# EAGLE design emonTx SMT07 (EAGLE 6.2)
ABBREV: emonTx; DRAWING_AUTHOR: Glyn Hudson; PROJECT: OpenEnergyMonitor
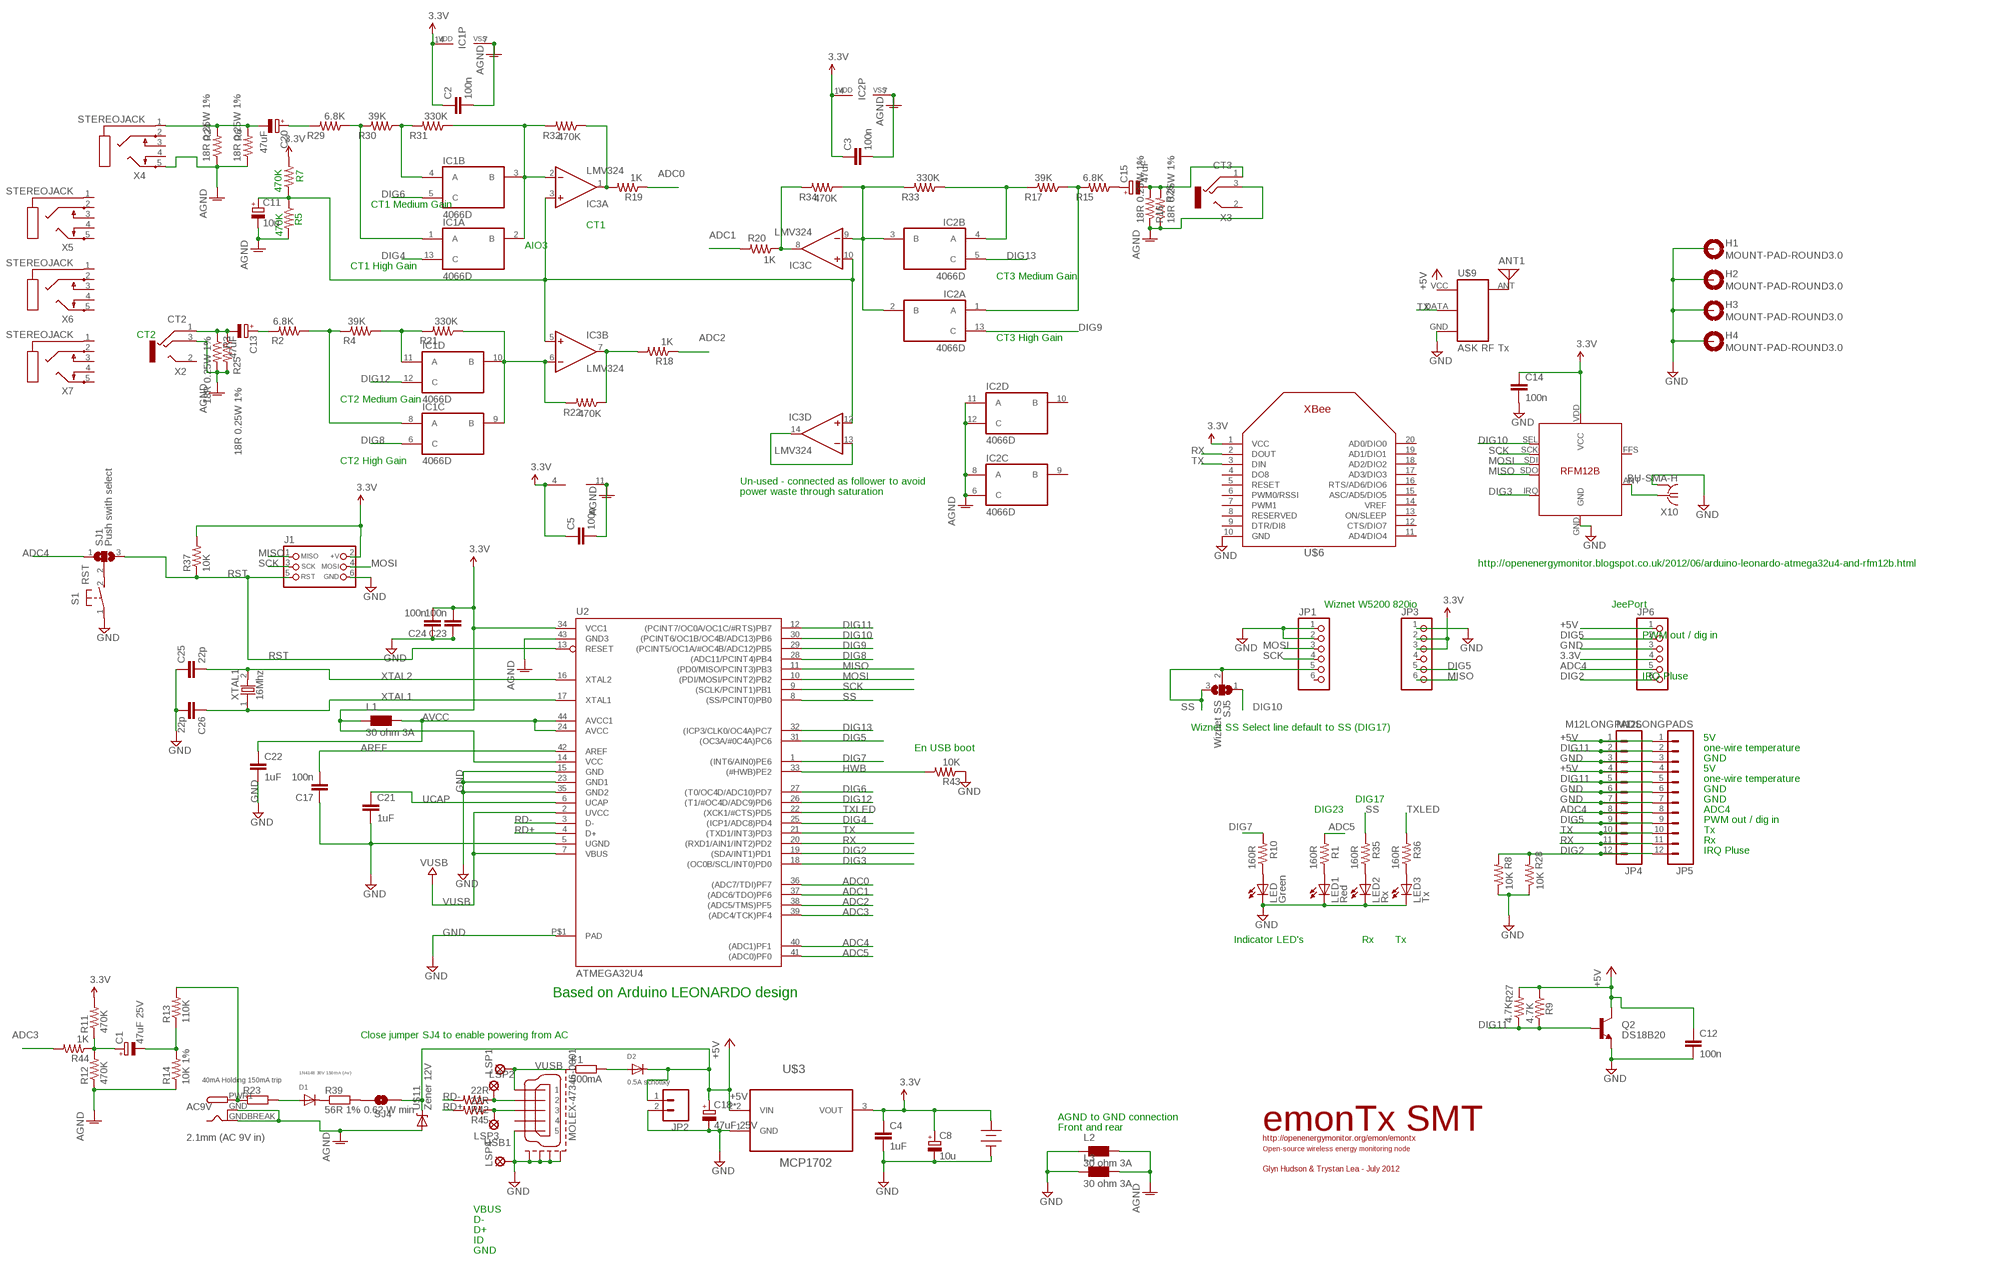
[diagram p0: schematic, sheet 1]

## Parts
3XAAA  4.5V  3X_AAA_BATTERY_HOLDER  [AAA_PCB_HOLDER]
AC9V  2.1mm (AC 9V in)  DCBARRELSMT  [DCJACK_2MM_SMT]
ANT1  ANTENNA  [PAD-01]
C1  47uF 25V  CPOL-EUD  [PANASONIC_D]
C2  100n  CAP0603-CAP  [0603-CAP]
C3  100n  CAP0603-CAP  [0603-CAP]
C4  1uF  C-EUC0603  [C0603]
C5  100n  CAP0603-CAP  [0603-CAP]
C8  10u  CPOL-EUB  [PANASONIC_B]
C11  10u  CPOL-EUB  [PANASONIC_B]
C12  100n  CAP0603-CAP  [0603-CAP]
C13  47uF  CPOL-EUD  [PANASONIC_D]
C14  100n  CAP0603-CAP  [0603-CAP]
C15  47uF  CPOL-EUD  [PANASONIC_D]
C17  100n  CAP0603-CAP  [0603-CAP]
C18  47uF 25V  CPOL-EUD  [PANASONIC_D]
C20  47uF  CPOL-EUD  [PANASONIC_D]
C21  1uF  CAP0603-CAP  [0603-CAP]
C22  1uF  C-EUC0603  [C0603-ROUND]
C23  100n  CAP0603-CAP  [0603-CAP]
C24  100n  CAP0603-CAP  [0603-CAP]
C25  22p  CAP0603-CAP  [0603-CAP]
C26  22p  CAP0603-CAP  [0603-CAP]
D1  1N4148 30V 150mA (Av)  DIODESOD-323F  [SOD-323F]
D2  0.5A schottky  DIODESOD-123  [SOD-123]
F1  500mA  R-EU_R1210  [R1210]
H1  MOUNT-PAD-ROUND3.0  [3,0-PAD]
H2  MOUNT-PAD-ROUND3.0  [3,0-PAD]
H3  MOUNT-PAD-ROUND3.0  [3,0-PAD]
H4  MOUNT-PAD-ROUND3.0  [3,0-PAD]
IC1  4066D  [SO14]
IC2  4066D  [SO14]
IC3  LMV324  OPA4134UA  [SO14]
J1  CON_HEADER_PRG_AVR_ICSP  [HEADER_PRG_2X03]
JP1  PINHD-1X6  [1X06]
JP2  M02LOCK_LONGPADS  [1X02_LOCK_LONGPADS]
JP3  PINHD-1X6  [1X06]
JP4  M12LONGPADS  [1X12_LONGPADS]
JP5  M12LONGPADS  [1X12_LONGPADS]
JP6  PINHD-1X6  [1X06]
L1  30 ohm 3A  WE-CBF_0603  [0603]
L2  30 ohm 3A  WE-CBF_0603  [0603]
L3  30 ohm 3A  WE-CBF_0603  [0603]
LED  Green  LEDCHIPLED_0603  [CHIPLED_0603]
LED1  Red  LEDCHIPLED_0603  [CHIPLED_0603]
LED2  Rx  LEDCHIPLED_0603  [CHIPLED_0603]
LED3  Tx  LEDCHIPLED_0603  [CHIPLED_0603]
LSP1  LSP11  [LSP11]
LSP2  LSP11  [LSP11]
LSP3  LSP11  [LSP11]
LSP4  LSP11  [LSP11]
Q2  DS18B20  TRANSISTOR_NPNTO92  [TO-92]
R1  160R  RESISTOR0603-RES  [0603-RES]
R2  6.8K  RESISTOR0603-RES  [0603-RES]
R3  18R 0.25W 1%  RESISTOR1206  [1206]
R4  39K  RESISTOR0603-RES  [0603-RES]
R5  470K  RESISTOR0603-RES  [0603-RES]
R6  18R 0.25W 1%  RESISTOR1206  [1206]
R7  470K  RESISTOR0603-RES  [0603-RES]
R8  10K  RESISTOR0603-RES  [0603-RES]
R9  4.7K  RESISTOR1206  [1206]
R10  160R  RESISTOR0603-RES  [0603-RES]
R11  470K  RESISTOR0603-RES  [0603-RES]
R12  470K  RESISTOR0603-RES  [0603-RES]
R13  110K  RESISTOR0603-RES  [0603-RES]
R14  10K 1%  RESISTOR0603-RES  [0603-RES]
R15  6.8K  RESISTOR0603-RES  [0603-RES]
R16  18R 0.25W 1%  RESISTOR1206  [1206]
R17  39K  RESISTOR0603-RES  [0603-RES]
R18  1K  RESISTOR0603-RES  [0603-RES]
R19  1K  RESISTOR0603-RES  [0603-RES]
R20  1K  RESISTOR0603-RES  [0603-RES]
R21  330K  RESISTOR0603-RES  [0603-RES]
R22  470K  RESISTOR0603-RES  [0603-RES]
R23  40mA Holding 150mA trip  R-EU_R1210  [R1210]
R24  18R 0.25W 1%  RESISTORPTH-1/4W  [AXIAL-0.4]
R25  18R 0.25W 1%  RESISTORPTH-1/4W  [AXIAL-0.4]
R26  18R 0.25W 1%  RESISTORPTH-1/4W  [AXIAL-0.4]
R27  4.7K  RESISTORPTH-1/4W  [AXIAL-0.4]
R28  10K  RESISTORPTH-1/4W  [AXIAL-0.4]
R29  6.8K  RESISTOR0603-RES  [0603-RES]
R30  39K  RESISTOR0603-RES  [0603-RES]
R31  330K  RESISTOR0603-RES  [0603-RES]
R32  470K  RESISTOR0603-RES  [0603-RES]
R33  330K  RESISTOR0603-RES  [0603-RES]
R34  470K  RESISTOR0603-RES  [0603-RES]
R35  160R  RESISTOR0603-RES  [0603-RES]
R36  160R  RESISTOR0603-RES  [0603-RES]
R37  10K  RESISTOR0603-RES  [0603-RES]
R39  56R 1% 0.62 W min  RESISTOR_R-EU_R2010  [RESISTOR_R2010]
R42  22R  RESISTOR0603-RES  [0603-RES]
R43  10K  RESISTOR0603-RES  [0603-RES]
R44  1K  RESISTOR0603-RES  [0603-RES]
R45  22R  RESISTOR0603-RES  [0603-RES]
S1  RST  31-XX  [B3F-31XX]
SJ1  Push swith select  SJ2WW  [SJ_2W]
SJ4  SOLDERJUMPER-OLDNO  [SJ_2S-NO]
SJ5  Wiznet SS  SJ2WW  [SJ_2W]
U2  ATMEGA32U4  ATMEGA32U4-XUAU  [TQFP44-PAD]
U$1  RFM12B  [RFM12B]
U$3  MCP1702  [SOT89]
U$6  XBEE  [XBEE]
U$9  ASK RF Tx  RF-LINK_TX  [RF-LINK_TX]
U$11  Zener 12V  DIODE-ZENER-BZT52  [SOD-323]
USB1  MOLEX-47346-0001  [MOLEX-47364-0001]
X2  CT2  1503_02  [1503_02]
X3  CT3  1503_02  [1503_02]
X4  STEREOJACK  [STX3100]
X5  STEREOJACK  [STX3100]
X6  STEREOJACK  [STX3100]
X7  STEREOJACK  [STX3100]
X10  BU-SMA-H  [BU-SMA-H]
XTAL1  16Mhz  OSC-XTAL-HC-49U  [HC-49U]

## Nets
3.3V [power]: 3XAAA.+ C2.1 C3.1 C4.1 C5.1 C8.+ C14.1 C23.2 C24.2 IC1.14(P:VDD) IC2.14(P:VDD) IC3.4(P:V+) J1.2(+V) JP3.2 JP3.3 JP6.4 L1.1 R7.2 R11.2 R37.2 U2.14(VCC) U2.34(VCC1) U$1.VDD(VCC) U$3.3(VOUT) U$6.1(VCC)
+5V [power]: C12.1 C18.+ D2.C JP2.1 JP4.1 JP4.4 JP5.1 JP5.4 JP6.1 Q2.3(C) R9.1 R27.P$2 SJ4.1 U$3.2(VIN) U$3.2.1(VIN) U$11.1(C)
ADC0: R19.1 U2.36((ADC7/TDI)PF7)
ADC1: R20.2 U2.37((ADC6/TDO)PF6)
ADC2: R18.1 U2.38((ADC5/TMS)PF5)
ADC3: R44.2 U2.39((ADC4/TCK)PF4)
ADC4: JP4.8 JP5.8 JP6.5 SJ1.1 U2.40((ADC1)PF1)
ADC5: R1.2 U2.41((ADC0)PF0)
AGND [gnd]: AC9V.GND(GNDBREAK) AC9V.GNDBREAK(GND) C2.2 C3.2 C5.2 C11.- IC1.7(P:VSS) IC2.6(C:C) IC2.7(P:VSS) IC2.8(C:A) IC2.11(D:A) IC2.12(D:C) IC3.11(P:V-) L2.2 L3.2 R3.2 R5.2 R6.1 R12.1 R14.1 R16.1 R24.P$1 R25.P$2 R26.P$1 U2.43(GND3) U$11.2(A) X2.3 X3.3 X4.5
AREF [aref]: C17.2 U2.42(AREF)
AVCC: C22.1 L1.2 U2.24(AVCC) U2.44(AVCC1)
DIG2: JP4.12 JP5.12 JP6.6 R8.2 R28.P$2 U2.19((SDA/INT1)PD1)
DIG3: U2.18((OC0B/SCL/INT0)PD0) U$1.IRQ
DIG4 [power]: IC1.13(A:C) U2.25((ICP1/ADC8)PD4)
DIG5: JP3.5 JP4.9 JP5.9 JP6.2 U2.31((OC3A/#0C4A)PC6)
DIG6: IC1.5(B:C) U2.27((T0/OC4D/ADC10)PD7)
DIG7: R10.2 U2.1((INT6/AIN0)PE6)
DIG8: IC1.6(C:C) U2.28((ADC11/PCINT4)PB4)
DIG9: IC2.13(A:C) U2.29((PCINT5/OC1A/#OC4B/ADC12)PB5)
DIG10: SJ5.1 U2.30((PCINT6/OC1B/OC4B/ADC13)PB6) U$1.SEL
DIG11: JP4.2 JP4.5 JP5.2 JP5.5 Q2.2(B) R9.2 R27.P$1 U2.12((PCINT7/OC0A/OC1C/#RTS)PB7)
DIG12: IC1.12(D:C) U2.26((T1/#OC4D/ADC9)PD6)
DIG13: IC2.5(B:C) U2.32((ICP3/CLK0/OC4A)PC7)
GND [gnd]: 3XAAA.- C4.2 C8.- C12.2 C14.2 C17.1 C18.- C21.2 C22.2 C23.1 C24.1 C25.1 C26.2 H1.B3,0(MOUNT) H2.B3,0(MOUNT) H3.B3,0(MOUNT) H4.B3,0(MOUNT) J1.6(GND) JP1.1 JP1.2 JP2.2 JP3.1 JP4.3 JP4.6 JP4.7 JP5.3 JP5.6 JP5.7 JP6.3 L2.1 L3.1 LED1.C LED2.C LED3.C LED.C LSP4.MP Q2.1(E) R8.1 R28.P$1 R43.1 S1.1(P) U2.5(UGND) U2.15(GND) U2.23(GND1) U2.35(GND2) U2.P$1(PAD) U$1.GND U$3.1(GND) U$6.10(GND) U$9.GND USB1.5 USB1.GND1 USB1.GND2 USB1.GND3 USB1.GND4 X10.2(GND)
HWB: R43.2 U2.33((#HWB)PE2)
MISO: J1.1(MISO) JP3.6 U2.11((PD0/MISO/PCINT3)PB3) U$1.SDO
MOSI: J1.4(MOSI) JP1.3 U2.10((PDI/MOSI/PCINT2)PB2) U$1.SDI
N$1: S1.2(S) SJ1.2
N$2: LED.A R10.1
N$3 [power]: AC9V.PWR1(PWR) R13.2 R23.1
N$4 [power]: D2.A F1.2
N$5: C1.- R13.1 R14.2
N$6 [power]: D1.C R39.1
N$7: C20.+ R29.2
N$8: LED1.A R1.1
N$9: C1.+ R11.1 R12.2 R44.1
N$10: R39.2 SJ4.2
N$11 [Ant]: ANT1.1 U$9.ANT
N$12: LSP2.MP R42.1 USB1.2
N$13: U$1.ANT X10.1
N$14: C15.- R16.2 R26.P$2 X3.1
N$15: LSP3.MP R45.1 USB1.3
N$16: IC1.4(B:A) R30.1 R31.2
N$17: IC1.1(A:A) R29.1 R30.2
N$18: C13.+ R2.2
N$19: LED2.A R35.1
N$20: C13.- R3.1 R25.P$1 X2.1
N$21: C20.- R6.2 R24.P$2 X4.1
N$22: C11.+ IC3.3(A:+IN) IC3.5(B:+IN) IC3.10(C:+IN) IC3.12(D:+IN) R5.1 R7.1
N$23: C15.+ R15.1
N$24: IC1.8(C:A) R2.1 R4.2
N$25: IC1.11(D:A) R4.1 R21.2
N$26: IC3.7(B:OUT) R18.2 R22.1
N$27: IC1.9(C:B) IC1.10(D:B) IC3.6(B:-IN) R21.1 R22.2
N$28: IC1.2(A:B) IC1.3(B:B) IC3.2(A:-IN) R31.1 R32.2
N$29: IC3.1(A:OUT) R19.2 R32.1
N$30: LED3.A R36.1
N$31: IC2.2(A:B) IC2.3(B:B) IC3.9(C:-IN) R33.2 R34.1
N$32: IC3.13(D:-IN) IC3.14(D:OUT)
N$33: IC3.8(C:OUT) R20.1 R34.2
N$34: IC2.1(A:A) R15.2 R17.1
N$35: IC2.4(B:A) R17.2 R33.1
N$36: D1.A R23.2
RD+: R45.2 U2.4(D+)
RD-: R42.2 U2.3(D-)
RST: J1.5(RST) R37.1 SJ1.3 U2.13(RESET)
RX: JP4.11 JP5.11 U2.20((RXD1/AIN1/INT2)PD2) U$6.2(DOUT)
SCK: J1.3(SCK) JP1.4 U2.9((SCLK/PCINT1)PB1) U$1.SCK
SS: JP1.5 R35.2 SJ5.2 SJ5.3 U2.8((SS/PCINT0)PB0)
TX: JP4.10 JP5.10 U2.21((TXD1/INT3)PD3) U$6.3(DIN) U$9.DATA
TXLED: R36.2 U2.22((XCK1/#CTS)PD5)
UCAP: C21.1 U2.6(UCAP)
VUSB: F1.1 LSP1.MP U2.2(UVCC) U2.7(VBUS) USB1.1
XTAL1: C26.1 U2.17(XTAL1) XTAL1.1
XTAL2: C25.2 U2.16(XTAL2) XTAL1.2
Unconnected: IC2.9(C:B) IC2.10(D:B) JP1.6 JP3.4 U$1.FFS U$6.4(DO8) U$6.5(RESET) U$6.6(PWM0/RSSI) U$6.7(PWM1) U$6.8(RESERVED) U$6.9(DTR/DI8) U$6.11(AD4/DIO4) U$6.12(CTS/DIO7) U$6.13(ON/SLEEP) U$6.14(VREF) U$6.15(ASC/AD5/DIO5) U$6.16(RTS/AD6/DIO6) U$6.17(AD3/DIO3) U$6.18(AD2/DIO2) U$6.19(AD1/DIO1) U$6.20(AD0/DIO0) USB1.4 X2.2 X2.2@2 X3.2 X3.2@2 X4.2 X4.3 X4.4 X5.1 X5.2 X5.3 X5.4 X5.5 X6.1 X6.2 X6.3 X6.4 X6.5 X7.1 X7.2 X7.3 X7.4 X7.5

## Notes on the sheet
- CT1 Medium Gain
- CT1
- AIO3
- CT1 High Gain
- CT3 Medium Gain
- CT2
- CT3 High Gain
- CT2 Medium Gain
- CT2 High Gain
- Un-used - connected as follower to avoid
- power waste through saturation
- http://openenergymonitor.blogspot.co.uk/2012/06/arduino-leonardo-atmega32u4-and-rfm12b.html
- Wiznet W5200 820io | JeePort
- PWM out / dig in
- IRQ Pluse
- Wiznet SS Select line default to SS (DIG17)
- 5V
- En USB boot | one-wire temperature
- GND
- 5V
- one-wire temperature
- GND
- DIG17 | GND
- DIG23 | ADC4
- PWM out / dig in
- Tx
- Rx
- IRQ Pluse
- Indicator LED's | Rx       Tx
- Based on Arduino LEONARDO design
- Close jumper SJ4 to enable powering from AC
- AGND to GND connection
- Front and rear | emonTx SMT
- http://openenergymonitor.org/emon/emontx
- Open-source wireless energy monitoring node
- Glyn Hudson & Trystan Lea - July 2012
- VBUS
- D-
- D+
- ID
- GND

## Power pins joined to a net without a drawn wire
+5V: U$9.VCC(+5V)
GND: X10.3(GND) X10.4(GND) X10.5(GND)

## Library data of the parts
3XAAA = Battery Holders:3X_AAA_BATTERY_HOLDER: 3x AA Battery Holder; RAPID_OC: 18-2967
AC9V = adafruit:DCBARREL: 2.0mm DC Barrel Jack DCJACK_2MM_PTH - Through Hole Jack (4UConnector: 05537)
ANT1 = discrete:ANTENNA: Antenna
C1 C13 C15 C18 C20 = rcl:CPOL-EU: POLARIZED CAPACITOR, European symbol
C2 C3 C5 C12 C14 C17 C21 C23-C26 = SparkFun:CAP: Capacitor Standard 0603 ceramic capacitor, and 0.1" leaded capacitor.
C4 = rcl:C-EU: CAPACITOR, European symbol
C8 C11 = resistor:CPOL-EU: POLARIZED CAPACITOR, European symbol
C22 = SmartPrj:C-EU: CAPACITOR, European symbol
D1 D2 = adafruit:DIODE: Diode SMADIODE - SMA Surface Mount Package 20V 1A Schottky Diode Digikey: 641-1014-6-ND DO-1N4148 - Through Hole Small Current Diode SOD-123 20V 1 A (.5mV Vf) Schottky Diode - Digikey: MBRX120TPMSCT-ND SOD-323 10V 570mA (.38mV Vf, 3ns) Schottky Diode - Digikey: ZLLS410CT-ND SOD-523 30V 30mA Schottky Diode (RB751S-40TE61) - Digikey: RB751S-40TE61CT-ND SOT23-R/W - SOT23 Package (R = Solder Paste/Reflow Ovens, W = Hand-Soldering) BAT54Film 40V 300mA - Digikey: 497-7162-1-ND
F1 R23 = rcl:R-EU_: RESISTOR, European symbol
H1-H4 = holes:MOUNT-PAD-ROUND: MOUNTING PAD, round
IC1 IC2 = 40xx:4066: Quad bilateral ANALOG SWITCH
IC3 = linear:OPA4*: Quad Operational Amplifier compatible with: TLC27L4 Low Power, Single-Supply, Rail-To-Rail Operational Amplifier Source: http://focus.ti.com/lit/ds/symlink/opa2345.pdf http://focus.ti.com .. opa241.pdf http://focus.ti.com .. tlc27l4.pdf http://focus.ti.com/lit/ds/symlink/opa2134.pdf
J1 = dp_devices:CON_HEADER_PRG_AVR_ICSP: 2x3 AVR ICSP programming header
JP1 JP3 JP6 = adafruit:PINHD-1X6: PIN HEADER
JP2 = SparkFun:M02: Header 2 Standard 2-pin 0.1" header. Use with straight break away headers (SKU : PRT-00116), right angle break away headers (PRT-00553), swiss pins (PRT-00743), machine pins (PRT-00117), and female headers (PRT-00115). Molex polarized connector foot print use with SKU : PRT-08233 with associated crimp pins and housings.
JP4 JP5 = SparkFun:M12: Header 12 Standard 12-pin 0.1" header. Use with straight break away headers (SKU : PRT-00116), right angle break away headers (PRT-00553), swiss pins (PRT-00743), machine pins (PRT-00117), and female headers (PRT-00115).
L1-L3 = wuerth-elektronik:WE-CBF: SMD EMI Suppression Ferrite Beads - excellent anti-EMI properties - low DCR - impedances till 3000 ohms - rated current up to 6 A
LED LED1-LED3 = adafruit:LED: LED OSRAM: - CHIPLED LG R971, LG N971, LY N971, LG Q971, LY Q971, LO R971, LY R971 LH N974, LH R974 LS Q976, LO Q976, LY Q976 LO Q996 - Hyper CHIPLED LW Q18S LB Q993, LB Q99A, LB R99A - SideLED LS A670, LO A670, LY A670, LG A670, LP A670 LB A673, LV A673, LT A673, LW A673 LH A674 LY A675 LS A676, LA A676, LO A676, LY A676, LW A676 LS A679, LY A679, LG A679 - Hyper Micro SIDELED® LS Y876, LA Y876, LO Y876, LY Y876 LT Y87S - SmartLED LW L88C, LW L88S LB L89C, LB L89S, LG L890 LS L89K, LO L89K, LY L89K LS L896, LA L896, LO L896, LY L896 - TOPLED LS T670, LO T670, LY T670, LG T670, LP T670 LSG T670, LSP T670, LSY T670, LOP T670, LYG T670 LG T671, LOG T671, LSG T671 LB T673, LV T673, LT T673, LW T673 LH T674 LS T676, LA T676, LO T676, LY T676, LB T676, LH T676, LSB T676, LW T676 LB T67C, LV T67C, LT T67C, LS T67K, LO T67K, LY T67K, LW E67C LS E67B, LA E67B, LO E67B, LY E67B, LB E67C, LV E67C, LT E67C LW T67C LS T679, LY T679, LG T679 LS T770, LO T770, LY T770, LG T770, LP T770 LB T773, LV T773, LT T773, LW T773 LH T774 LS E675, LA E675, LY E675, LS T675 LS T776, LA T776, LO T776, LY T776, LB T776 LHGB T686 LT T68C, LB T68C - Hyper Mini TOPLED® LB M676 - Mini TOPLED Santana® LG M470 LS M47K, LO M47K, LY M47K Source: http://www.osram.convergy.de/
LSP1-LSP4 = solpad:LSP11: SOLDER PAD drill 1.1 mm
Q2 = SparkFun:TRANSISTOR_NPN: Transistor NPN BJT configuration in SOT23 package. MMBT2222 is the common NPN we use. Double check BCE configuration again layout.
R1-R22 R24-R37 R42-R45 = SparkFun:RESISTOR: Resistor Basic schematic elements and footprints for 0603, 1206, and PTH resistors.
R39 = jeenodes:RESISTOR_R-EU_: RESISTOR, European symbol
S1 = adafruit:31-XX: OMRON SWITCH Now with beefier pads!
SJ1 SJ5 = jumper:SJ2W: SMD solder JUMPER
SJ4 = SparkFun:SOLDERJUMPER-OLD: Solder Jumper Standard SMD solder jumper. Used to automate production. Two varients : Normally Open and Normally Closed are the same, but have different paste layers. NC will have a large amount of paste and should jumper during reflow.
U2 = SmartPrj:ATMEGA32U4-XU
U$1 = JeeLabs:RFM12B
U$3 = OpenEnergyMonitor:MCP1702: Low Quiescent Current LDO; OUTPUT: 3.3V
U$6 = adafruit:XBEE
U$9 = SparkFun:RF-LINK_TX
U$11 = SparkFun:DIODE-ZENER: Zener Diode Production Part - 8199 3.4V Zener Voltage
USB1 = usb_con-update:MOLEX-47346-0001: MICRO USB B, BOTTOM MOUNT
X2 X3 = con-lumberg:1503_02: Jack connectors according to JISC 6560, 3.5 mm Klinkeneinbaukupplung nach JISC 6560, 3,5 mm, 3-polig/stereo, abgewinkelte Ausführung, Surface-Mount-Technik (SMT) Source: http://www.lumberg.com/Produkte/PDFs/1503_02.pdf; OC_FARNELL: 1216979; OC_NEWARK: unknown
X4-X7 = adafruit:STEREOJACK: MIC/HEADPHONE JACK Stereo jack with two switches. Kycon STX3100, CUI SJ1-3555NG and/or 4UCon 05544
X10 = con-coax:BU-SMA-H: FEMALE SMA CONNECTOR Radiall; OC_FARNELL: unknown; OC_NEWARK: unknown
XTAL1 = dp_devices:OSC-XTAL

## Net classes
0 default: width 0.152 mm, drill 0.35 mm, clearance 0.152 mm
1 power: width 0.305 mm, drill 0.35 mm, clearance 0.203 mm
2 gnd: width 0.305 mm, drill 0.35 mm, clearance 0.203 mm
3 usbvcc: width 0.152 mm, drill 0.35 mm, clearance 0.203 mm
4 aref: width 0.152 mm, drill 0.35 mm, clearance 0.203 mm
5 Ant: width 1.016 mm, drill 0.35 mm, clearance 0.762 mm

## Board
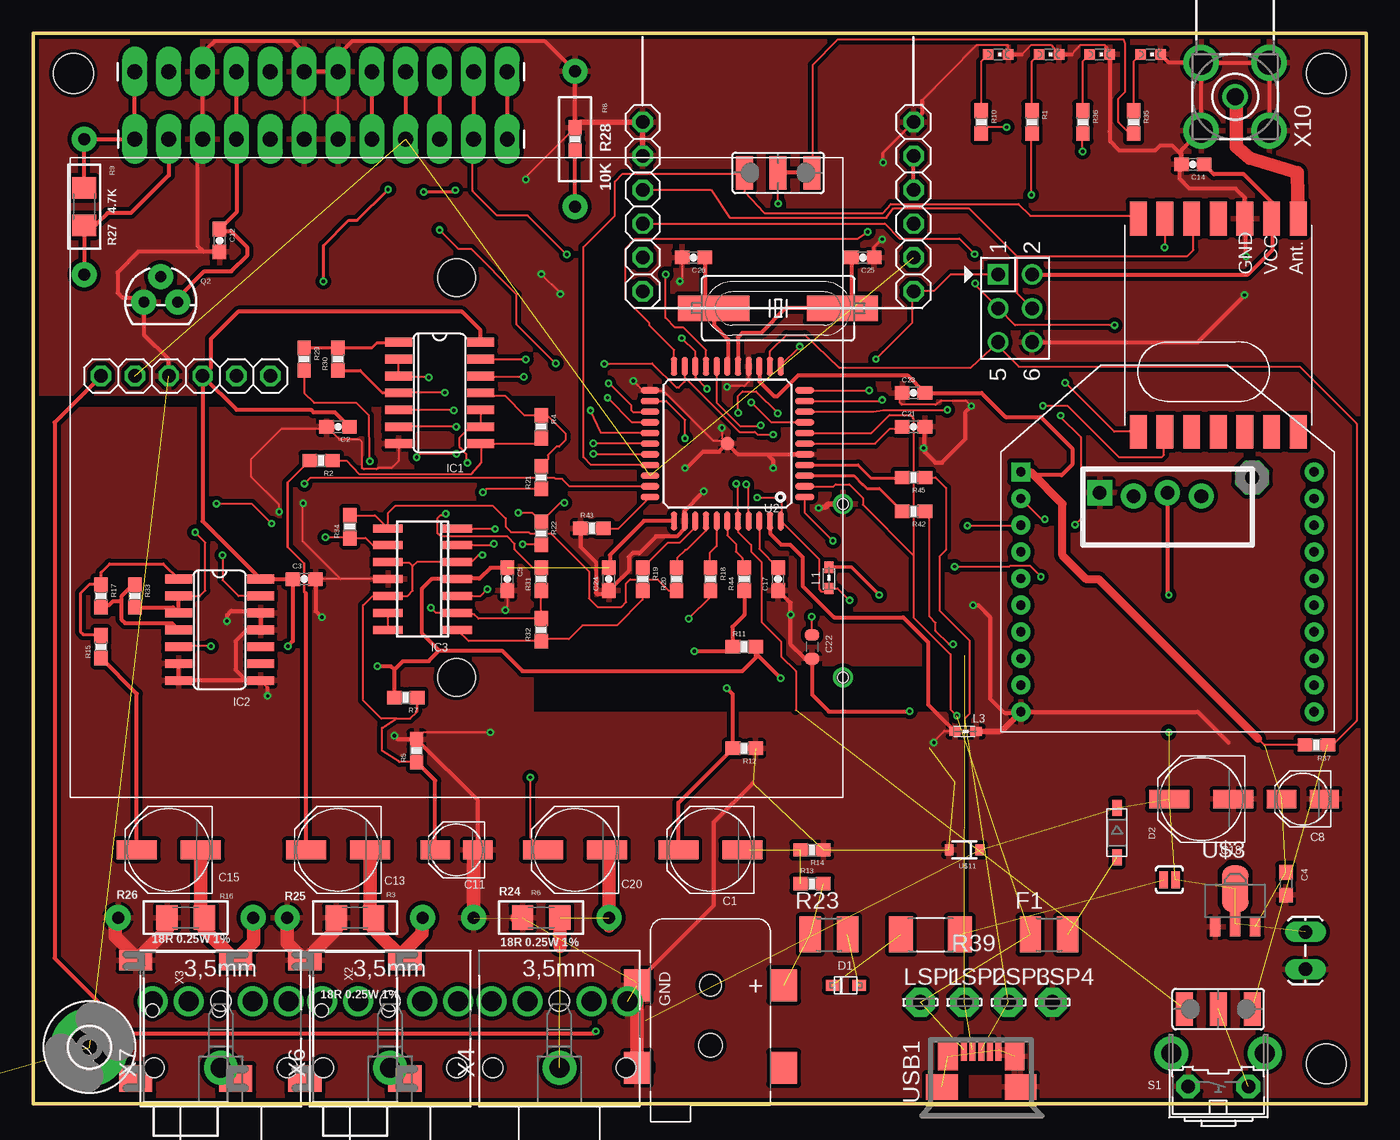
[diagram p1: board, top side]
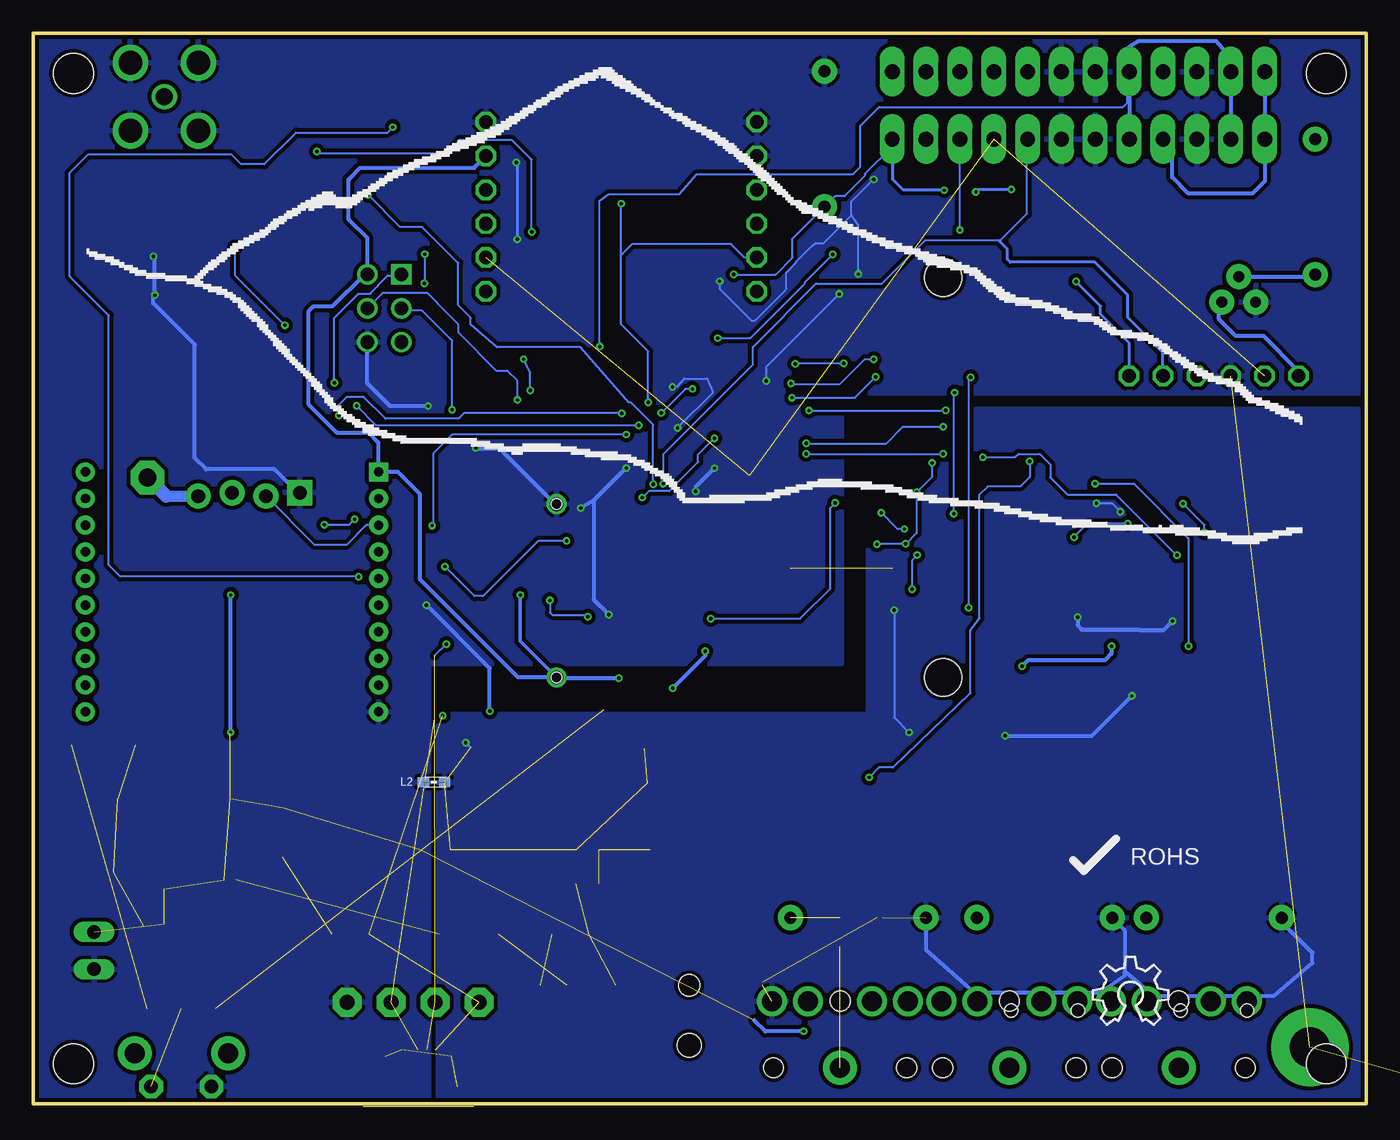
[diagram p2: board, bottom side, seen from below]

Size 100 x 80.32 mm. Coordinates in mm from the lower left corner, seen from the top.
Outline: 0,80.32 100,80.32 100,0 0,0 0,80.32
Copper layers (1*16): Top 0.035mm / dielectric 1.5mm / Bottom 0.035mm
Design rules: minimum track width 6mil, minimum drill 0.35mm, track to track 6mil, track to pad 6mil, pad to pad 6mil, via to via 6mil, smd to smd 0mil, copper to edge 10mil, drill to drill 10mil, minimum pad ring 10mil, minimum via ring 6mil, stop-mask expansion 2mil, vias tented up to drill 100mil, thermal gap 10mil
Holes 3 mm at 3,77.32 97,77.32 97,3 3,3

### Footprints (pad centres in the part's own frame; a part is rotated, then mirrored left to right if it is on the bottom)
AAA_PCB_HOLDER = drill 1: + 29,-15; - 29,-2 | hole 0.8: 29,-15; 29,-2 | hole 2.8: 0,15; 0,-15
DCJACK_2MM_SMT = smd 2.4 x 2: GND 0,-5.5; GNDBREAK 6.2,-5.5; PWR1 0,5.5; PWR2 6.2,5.5 | hole 1.6: 0,0 | hole 1.8: 4.5,0
PAD-01 = drill 1.321 pad 2.54 octagon: 1 0,0
PANASONIC_D = smd 3 x 1.4: + 2.4,0; - -2.4,0
0603-CAP = smd 1.1 x 1: 1 -0.85,0; 2 0.85,0
C0603 = smd 1.1 x 1: 1 -0.85,0; 2 0.85,0
PANASONIC_B = smd 2.2 x 1.4: + 1.6,0; - -1.6,0
C0603-ROUND = smd 0.898 x 1.1: 1 -0.889,0; 2 0.889,0
SOD-323F = smd 1 x 0.8: A -1,0; C 1,0
SOD-123 = smd 1.2 x 0.7: A 1.85,0; C -1.85,0
R1210 = smd 1.6 x 2.7: 1 -1.4,0; 2 1.4,0
3,0-PAD = drill 3 pad 5.842: B3,0 0,0
SO14 = smd 0.66 x 2.032: 1 -3.81,-3.073; 2 -2.54,-3.073; 3 -1.27,-3.073; 4 0,-3.073; 5 1.27,-3.073; 6 2.54,-3.073; 7 3.81,-3.073; 8 3.81,3.073; 9 2.54,3.073; 10 1.27,3.073; 11 0,3.073; 12 -1.27,3.073; 13 -2.54,3.073; 14 -3.81,3.073
SO14' = smd 0.6 x 2.2: 1 -3.81,-2.6; 2 -2.54,-2.6; 3 -1.27,-2.6; 4 0,-2.6; 5 1.27,-2.6; 6 2.54,-2.6; 7 3.81,-2.6; 8 3.81,2.6; 9 2.54,2.6; 10 1.27,2.6; 11 0,2.6; 12 -1.27,2.6; 13 -2.54,2.6; 14 -3.81,2.6
HEADER_PRG_2X03 = drill 1.016 square: 1 -2.54,-1.27 | drill 1.016: 2 -2.54,1.27; 3 0,-1.27; 4 0,1.27; 5 2.54,-1.27; 6 2.54,1.27
1X06 = drill 1.016 octagon: 1 -6.35,0; 2 -3.81,0; 3 -1.27,0; 4 1.27,0; 5 3.81,0; 6 6.35,0
1X02_LOCK_LONGPADS = drill 1.016 long: 1 -0.127,0; 2 2.667,0
1X12_LONGPADS = drill 1.118 pad 1.88 long: 1 0,0; 2 2.54,0; 3 5.08,0; 4 7.62,0; 5 10.16,0; 6 12.7,0; 7 15.24,0; 8 17.78,0; 9 20.32,0; 10 22.86,0; 11 25.4,0; 12 27.94,0
0603 = smd 0.85 x 0.7: 1 -0.9,0; 2 0.7,0
CHIPLED_0603 = smd 0.8 x 0.8: A 0,-0.75; C 0,0.75
LSP11 = drill 1.118 pad 2.159 octagon: MP 0,0
TO-92 = drill 0.813 pad 1.88: 1 -1.27,0; 2 0,1.905; 3 1.27,0
0603-RES = smd 1.1 x 1: 1 -0.85,0; 2 0.85,0
1206 = smd 1.6 x 1.8: 1 -1.4,0; 2 1.4,0
AXIAL-0.4 = drill 0.9 pad 1.88: P$1 -5.08,0; P$2 5.08,0
RESISTOR_R2010 = smd 1.8 x 2.7: 1 -2.2,0; 2 2.2,0
B3F-31XX = drill 1.016 pad 1.778 octagon: 1 -2.261,-1.245; 2 2.261,-1.245 | drill 1.499 pad 2.54: 3 -3.505,1.245; 4 3.505,1.245
SJ_2W = smd 1.27 x 2.54: 1 -2.54,0; 2 0,0; 3 2.54,0
SJ_2S-NO = smd 0.635 x 1.27: 1 -0.45,0; 2 0.45,0
TQFP44-PAD = smd 1.4 x 0.45: 1 -5.8,4; 2 -5.8,3.2; 3 -5.8,2.4; 4 -5.8,1.6; 5 -5.8,0.8; 6 -5.8,0; 7 -5.8,-0.8; 8 -5.8,-1.6; 9 -5.8,-2.4; 10 -5.8,-3.2; 11 -5.8,-4; 23 5.8,-4; 24 5.8,-3.2; 25 5.8,-2.4; 26 5.8,-1.6; 27 5.8,-0.8; 28 5.8,0; 29 5.8,0.8; 30 5.8,1.6; 31 5.8,2.4; 32 5.8,3.2; 33 5.8,4 | smd 0.45 x 1.4: 12 -4,-5.8; 13 -3.2,-5.8; 14 -2.4,-5.8; 15 -1.6,-5.8; 16 -0.8,-5.8; 17 0,-5.8; 18 0.8,-5.8; 19 1.6,-5.8; 20 2.4,-5.8; 21 3.2,-5.8; 22 4,-5.8; 34 4,5.8; 35 3.2,5.8; 36 2.4,5.8; 37 1.6,5.8; 38 0.8,5.8; 39 0,5.8; 40 -0.8,5.8; 41 -1.6,5.8; 42 -2.4,5.8; 43 -3.2,5.8; 44 -4,5.8 | smd 1 x 1: P$1 0,0
RFM12B = smd 2.54 x 1.27: ANT 8,-6; FFS -8,2; GND 8,-2; IRQ -8,4; P$8 -8,0; P$9 -8,-2; P$10 -8,-4; P$12 -8,-6; P$16 8,0; SCK 8,4; SDI 8,2; SDO -8,6; SEL 8,6; VDD 8,-4
SOT89 = smd 0.8 x 1.4: 1 -1.499,-1.981; 3 1.499,-1.981 | smd 0.8 x 1.9: 2 0,-1.727 | smd 2 x 3.5: 2.1 0,0.889
XBEE = drill 0.7 pad 1.422 square: 1 -11,5.5 | drill 0.7 pad 1.422: 2 -11,3.5; 3 -11,1.5; 4 -11,-0.5; 5 -11,-2.5; 6 -11,-4.5; 7 -11,-6.5; 8 -11,-8.5; 9 -11,-10.5; 10 -11,-12.5; 11 11,-12.5; 12 11,-10.5; 13 11,-8.5; 14 11,-6.5; 15 11,-4.5; 16 11,-2.5; 17 11,-0.5; 18 11,1.5; 19 11,3.5; 20 11,5.5
RF-LINK_TX = drill 1.016 pad 1.88: ANT 7.62,-0.127; DATA 2.54,-0.127; VCC 5.08,0.127 | drill 1.016 pad 1.88 square: GND 0,0.127
SOD-323 = smd 0.63 x 0.83: 1 -1.15,0; 2 1.15,0
MOLEX-47364-0001 = smd 1.7 x 0.45: 1 2.8,1.3; 2 2.8,0.65; 3 2.8,0; 4 2.8,-0.65; 5 2.8,-1.3 | smd 1.9 x 2.375: GND1 0,2.95; GND4 0,-2.95 | smd 2.1 x 1.475: GND2 2.3,2.5; GND3 2.3,-2.5
1503_02 = smd 2.5 x 1.5: 1 -3.75,-10.75; 3 3.75,-10.75 | smd 2.5 x 2: 2 -3.75,-1.9; 2@2 3.75,-1.9 | hole 1: -2.5,-7; 2.5,-7
STX3100 = drill 1.5 pad 2.54: 1 2.7,-0.1 | drill 1.5: 2 7.7,5; 3 7.7,2.3; 4 7.7,-2.5; 5 7.7,-5.2 | hole 1.5: 2.7,4.9; 2.7,-5.1; 7.7,-0.1
BU-SMA-H = drill 1.27: 1 0,0 | drill 1.778: 2 -2.55,2.55; 3 2.55,2.55; 4 2.55,-2.55; 5 -2.55,-2.55
HC-49U = smd 5.334 x 1.93: 1 -4.826,0; 2 4.826,0

### Placement (x,y rotation side)
3XAAA  31.75,46.99 0 top
AC9V  50.8,8.89 270 top
ANT1  91.44,46.99 0 top
C1  50.8,19.05 180 top
C2  22.86,50.8 180 top
C3  20.32,39.37 0 top
C4  93.98,16.51 270 top
C5  35.56,39.37 270 top
C8  95.25,22.86 180 top
C11  31.75,19.05 180 top
C12  13.97,64.77 270 top
C13  22.86,19.05 180 top
C14  87,70.48 180 top
C15  10.16,19.05 180 top
C17  55.88,39.37 90 top
C18  87.63,22.86 180 top
C20  40.64,19.05 180 top
C21  66.04,50.8 0 top
C22  58.42,34.29 270 top
C23  66.04,53.34 0 top
C24  43.18,39.37 90 top
C25  62.23,63.5 180 top
C26  49.53,63.5 180 top
D1  60.96,8.89 180 top
D2  81.3,20.34 270 top
F1  76.2,12.7 0 top
H1  4.22,4.24 0 top
H2  -30.56,-5.71 0 top  (outside the outline)
H3  -38.68,-5.71 0 top  (outside the outline)
H4  -46.81,-5.71 0 top  (outside the outline)
IC1  30.48,53.34 270 top
IC2  13.97,35.56 270 top
IC3  LMV324  [SO14']  29.21,39.37 90 top
J1  73.66,59.69 270 top
JP1  45.72,67.31 270 top
JP2  95.44,12.77 270 top
JP3  66.04,67.31 270 top
JP4  7.62,77.45 0 top
JP5  7.62,72.39 0 top
JP6  11.43,54.61 0 top
L1  59.69,39.37 270 top
L2  69.85,24.13 0 bottom
L3  69.85,27.94 180 top
LED  72.39,78.74 270 top
LED1  76.2,78.74 270 top
LED2  83.82,78.74 270 top
LED3  80.01,78.74 270 top
LSP1  66.55,7.62 0 top
LSP2  69.85,7.62 0 top
LSP3  73.15,7.62 0 top
LSP4  76.45,7.62 0 top
Q2  9.57,60.16 0 top
R1  74.93,73.66 270 top
R2  21.59,48.26 180 top
R3  24.13,13.97 180 top
R4  38.1,50.8 270 top
R5  28.75,26.49 90 top
R6  38.1,13.97 0 top
R7  27.94,30.48 180 top
R8  40.64,72.39 270 top
R9  3.81,67.31 270 top
R10  71.12,73.66 270 top
R11  53.34,34.29 0 top
R12  53.34,26.67 180 top
R13  58.42,16.51 0 top
R14  58.42,19.05 180 top
R15  5.08,34.29 90 top
R16  11.43,13.97 0 top
R17  5.08,38.1 270 top
R18  50.8,39.37 270 top
R19  45.72,39.37 270 top
R20  48.26,39.37 90 top
R21  38.1,46.99 90 top
R22  38.1,42.8 270 top
R23  59.69,12.7 0 top
R24  38.1,13.97 0 top
R25  24.13,13.97 180 top
R26  11.43,13.97 0 top
R27  3.81,67.31 90 top
R28  40.64,72.39 270 top
R29  20.32,55.88 270 top
R30  22.86,55.88 90 top
R31  38.1,39.37 90 top
R32  38.1,35.56 90 top
R33  7.62,38.1 270 top
R34  23.75,43.31 90 top
R35  82.55,73.66 270 top
R36  78.74,73.66 270 top
R37  96.27,26.92 180 top
R39  67.31,12.7 0 top
R42  66.04,44.45 180 top
R43  41.91,43.18 0 top
R44  53.34,39.37 90 top
R45  66.04,46.99 180 top
S1  88.9,2.54 0 top
SJ1  88.9,7.11 0 top
SJ4  85.23,16.81 180 top
SJ5  55.88,69.85 0 top
U2  52.07,49.53 180 top
U$1  88.9,58.42 90 top
U$2  Open-source Hardware  [OSHW_8X200_NOTEXT]  20.52,5.94 0 bottom
U$3  90.17,15.24 0 top
U$5  [CNICHT]  88.39,61.72 0 bottom
U$6  85.09,41.91 0 top
U$9  80.01,45.72 0 top
U$11  69.85,19.05 180 top
USB1  71.12,1.27 90 top
X2  24.13,0 180 top
X3  11.43,0 180 top
X4  39.37,0 90 top
X5  -78.74,-1.27 0 top  (outside the outline)
X6  26.67,0 90 top
X7  13.97,0 90 top
X10  90.17,75.56 90 top
XTAL1  55.88,59.69 0 top

### Tracks (layer width: path | path; a pad name or v marks a point on that pad's centre or on a via)
3.3V  (via drill 0.25)  (4 unrouted)
  Top 0.152: R37.2 92.35,26.92 91.87,27.41
  Top 0.254: L1.1 61.38,40.27 v63.48,38.18
  Top 0.305: C24.2 43.26,40.3 43.26,41.17 45.81,43.73 U2.34 48.08,43.74 | 74.83,47.4 74.1,47.4 U$6.1 | R7.2 27.09,32.58 | 27.09,32.58 27.74,33.22 29.67,33.22 30.45,34.01 | 30.45,34.01 35.15,34.01 36.7,32.46 53.19,32.46 54.19,33.46 R11.2 54.19,33.82 v56.08,31.93 | 30.45,34.01 29.13,35.33 29.13,38.63 29.87,39.37 IC3.4 31.84,39.4 33.48,39.4 34.3,40.22 C5.1 | v19.1,34.34 19.47,34.71 C3.1 IC2.14 12.7,43.71 JP6.4 | v25.81,32.84 26.82,32.84 27.09,32.58 | JP6.4 15.24,52.07 20.83,52.07 21.01,51.89 22.62,51.89 C2.1 | IC1.14 33.55,58.04 32.16,59.44 15.37,59.44 13.31,57.38 13.31,55.22 JP6.4 | J1.2 91.14,62.23 92.99,64.08 92.99,66.33 U$1.VDD 92.9,67.65 90.81,69.75 88.58,69.75 C14.1 87.92,70.41 | JP3.3 JP3.2 | 74.33,47.17 77.17,47.17 77.95,47.95 77.95,49.17 75.59,51.54 72.95,51.54 71.14,53.34 C23.2 65.57,54.66 57.4,54.66 55.83,53.09 55.58,53.09 54.47,54.19 U2.14
  Top 0.61: 91.87,27.41 79.93,39.34 79.02,39.34 77.22,41.15 77.22,45.01 74.83,47.4 | 74.33,47.17 U$6.1
  Bottom 0.254: v63.48,38.18 63.48,34.72 3XAAA.+
  Bottom 0.305: v19.1,34.34 19.1,33.78 19.61,33.27 25.38,33.27 v25.81,32.84 | JP3.2 66.93,70.23 75.46,70.23 76.35,69.34 76.38,69.34 76.33,69.29 76.33,66.34 74.93,64.95 J1.2 75.16,62.23 77.57,59.82 78.99,59.82 79.38,59.44 79.38,52.5 77.24,50.37 74.85,50.37 74.12,49.63 74.12,47.44 U$6.1 72.64,47.41 70.99,45.76 70.99,39.34 63.64,31.99 3XAAA.+ 60.69,31.93 v56.08,31.93
+5V  (via drill 0.25)  (8 unrouted)
  Top 0.152: JP4.1 | 85.23,27.82 v85.19,27.86
  Top 0.305: R9.1 R27.P$2 JP5.1 JP4.1 | JP4.4 JP5.4 15.24,66.89 C12.1 14.16,65.43 14.88,65.43 16.08,64.24 16.08,63.68 14.86,62.46 12.83,62.46 10.84,60.47 Q2.3 | U$9.VCC 85.09,38.28 v85.19,38.18 | v42.19,5.44 42.04,5.28 7.24,5.28 1.6,10.92 1.6,51.13 JP6.1
  Bottom 0.305: JP6.1 5.08,54.99 7.7,57.61 9.78,57.61 11.05,58.88 11.05,59.95 Q2.3 | v85.19,27.86 v85.19,38.18 | JP4.1 7.62,69.22 8.53,68.3 13.34,68.3 14.55,69.52 14.55,71.7 JP5.4 | v42.19,5.44 45.09,5.44 45.92,6.27
ADC0
  Top 0.152: U2.36 49.67,43.27 48.49,42.09 47.59,42.09 R19.1
ADC1
  Top 0.152: U2.37 50.47,43 49.02,41.55 48.92,41.55 48.31,40.95 48.31,40.27 R20.2
ADC2
  Top 0.152: U2.38 51.27,41.85 50.75,41.33 50.75,40.27 R18.1
ADC3
  Top 0.152: U2.39 52.07,42.65 52.7,42.01 52.7,41.43 53.19,40.95 53.19,40.37 R44.2
ADC4  (via drill 0.25)  (1 unrouted)
  Top 0.152: v52.73,46.53 52.87,46.39 U2.40 52.87,42.91 53.85,41.94 53.85,41.43 54.63,40.64 54.63,36.14 56.11,34.67 56.11,33.55 57.2,32.46 57.2,29.54
  Top 0.305: JP4.8 JP5.8
  Bottom 0.152: v52.73,46.53 52.73,48.74 46.02,55.45 46.02,56.79 41.27,61.54 36.32,61.54 33.07,64.8 27.58,64.8 27.43,64.8 25.45,66.78 25.45,72.34 JP5.8
  Bottom 0.229: JP6.5 15.24,56.36 17.88,59 17.88,60.68 20.34,63.14 26.7,63.14 26.92,63.37 26.92,64.14 27.58,64.8
ADC5  (via drill 0.25)
  Top 0.152: U2.41 53.67,46.3 v53.49,46.48 | v74.88,68.2 74.88,72.76 R1.2
  Bottom 0.152: v53.49,46.48 53.49,50.95 55.17,52.63 55.32,52.63 58.95,56.77 65.23,56.77 67.18,58.47 67.18,58.98 68.12,59.92 68.12,63.09 70.81,65.79 72.47,65.79 v74.88,68.2
AGND  (via drill 0.25)  (8 unrouted)
  Top 0.152: 17.58,31.22 IC2.8 | C3.2 IC3.11 23.04,39.37 20.19,42.22 20.19,45.01 v20.24,45.06 | 16.89,36.98 IC2.12 | C5.2 35.56,37.19 v35.41,37.03 | v34.29,27.86 29.27,27.86 R5.2 | 68.91,27.94 L3.2 69.1,27.99 68.35,27.99 67.56,27.2 v67.56,27.1 | IC1.7 27.41,48.23 26.87,47.7 25.88,47.7 25.83,47.65 25.81,47.65 25.73,47.62 24.79,47.62 24.66,47.7 24.66,49.66 24.49,49.84 22.98,49.84 C2.2 21.86,50.65 18.62,50.65 16.36,48.39 16.36,47.04 18.44,44.96 v18.44,44.42
  Top 0.305: C11.- 33.35,22.75 R5.2 27.34,27.34 v27.08,27.61 | v17.58,30.61 17.58,31.22 | U2.43 55.27,42.8 56.11,41.96 56.77,41.96 57.71,41.02 57.71,38.86 60.07,36.5 65.28,36.5 67.13,34.65 67.13,29.96 L3.2 | C3.2 21.17,36.97 v21.64,36.5 | v14.53,36.22 14.53,36.65 14.86,36.98 16.89,36.98 | IC2.12 IC2.11 16,35.56 15.16,34.72 15.16,32.56 15.98,31.75 | IC2.8 15.98,31.75 | 15.98,31.75 IC2.7 IC2.6 | R16.1 10.03,13.1 | AC9V.GND 45.3,9.13 51.05,14.88 51.05,21.13 53.98,24.05
  Top 1.016: R26.P$1 6.15,13.77 6.15,12.57 7.68,11.04 X3.3 10.03,13.1 | R25.P$2 19.05,12.08 X2.3 22.73,13.1 R3.2 | R6.1 36.3,13.97 | 33.08,13.91 R24.P$1 33.02,18.72 C11.- | AC9V.GNDBREAK AC9V.GND
  Bottom 0.152: 17.07,35.59 IC2.11 | v35.41,37.03 35.41,28.98 v34.29,27.86 | v20.24,45.06 19.07,45.06 v18.44,44.42 | 67.18,26.72 v67.56,27.1
  Bottom 0.305: v27.08,27.61 20.57,27.61 v17.58,30.61 | v21.64,36.5 21.64,35.89 21.34,35.59 17.07,35.59 | IC2.11 15.19,35.56 v14.53,36.22 | R24.P$1 33.02,11.56 29.41,8.38 19.94,8.38 18.11,9.63 18.11,9.96 | R25.P$2 18.11,13.03 18.11,9.96 | 18.11,9.96 15.93,8.1 6.93,8.1 4.04,10.57 4.04,11.33 6.15,13.44 6.15,13.77 R26.P$1
  pour Top (isolate 0.305): -2.54,52.07 -2.54,-2.54 69.6,-2.54 69.6,29.21 37.33,29.21 37.33,52.07
  pour Bottom (isolate 0.305): -2.54,52.07 -2.54,-2.54 69.6,-2.54 69.6,29.21 37.33,29.21 37.33,52.07
AREF
  Top 0.152: U2.42 54.47,41.63 C17.2
AVCC  (via drill 0.25)
  Top 0.152: U2.24 47.47,52.73 48.9,51.31 v48.9,49.94 | v54.3,45.49 55.7,45.49 56.13,45.06 56.13,43.79 U2.44 56.09,43.73 58.95,40.87 58.95,38.61 59.11,38.46 59.48,38.46 L1.2 60.34,38.67 v61.24,37.77 | v58.4,36.55 58.4,35.2 C22.1
  Bottom 0.152: v54.3,45.49 53.82,45.97 52.3,45.97 50.11,48.16 50.11,48.72 v48.9,49.94 | v61.24,37.77 61.24,36.85 61.06,36.68 58.52,36.68 v58.4,36.55
DIG2  (via drill 0.25)
  Top 0.152: U2.19 50.47,56.54 48.77,58.24 48.16,58.24 47.42,58.98 47.42,62.2 v47.45,62.23
  Top 0.229: v21.77,61.7 21.77,64.39 23.67,66.29 24.31,66.29 v26.62,68.61 | v29.29,68.43 31.55,68.43 v31.67,68.56
  Top 0.305: R28.P$2 R8.2 | JP4.12 JP5.12
  Bottom 0.152: v47.45,62.23 44.3,62.23 43.03,63.5 43.03,64.92 R28.P$2 39.85,68.1 39.14,68.1 37.62,69.62 37.62,69.77 35.56,71.83 JP5.12
  Bottom 0.229: JP6.6 17.78,57.07 19.94,59.23 19.94,59.87 v21.77,61.7 | v26.62,68.61 29.11,68.61 v29.29,68.43 | v31.67,68.56 34.72,68.56 35.51,69.34 35.51,72.34 JP5.12
DIG3  (via drill 0.25)
  Top 0.152: U2.18 51.27,52.62 53.03,50.85 54.53,50.85 v54.59,50.9 | v75.74,52.38 77.6,52.38 81.46,48.51 84.66,48.51 84.84,48.69 84.84,50.36 U$1.IRQ
  Bottom 0.152: v54.59,50.9 74.27,50.9 v75.74,52.38
DIG4  (via drill 0.25)
  Top 0.152: IC1.13 36.93,55.88 v36.96,55.85 | v43.16,54.05 43.23,54.05 44.86,52.43 44.86,52.05 44.98,51.92 46.26,51.92 U2.25
  Bottom 0.152: v36.96,55.85 37.64,55.85 39.52,53.98 43.08,53.98 v43.16,54.05
DIG5  (3 unrouted)
  Top 0.305: JP4.9 JP5.9
DIG6  (via drill 0.25)
  Top 0.152: U2.27 42.58,50.33 v41.81,52.02 | v31.55,52.05 27.43,52.05 IC1.5
  Bottom 0.152: v41.81,52.02 31.57,52.02 v31.55,52.05
DIG7  (via drill 0.25)
  Top 0.152: U2.1 57.87,44.37 v59.99,42.24 | v69.11,40.31 73.23,40.31 73.3,40.39 74.75,40.39 v75.59,39.55 | v73.03,73.28 71.59,73.28 R10.2
  Bottom 0.152: v59.99,42.24 62.13,42.24 66.27,38.1 66.9,38.1 v69.11,40.31 | v75.59,39.55 93.47,39.55 94.34,40.41 94.34,59.16 97.26,62.08 97.26,69.88 95.94,71.2 85.11,71.2 84.4,70.48 82.68,70.48 80.29,72.87 73.43,72.87 v73.03,73.28
DIG8  (via drill 0.25)
  Top 0.152: U2.28 v42.01,49.55 | v31.73,50.8 IC1.6
  Bottom 0.152: v42.01,49.55 35.99,49.55 34.75,50.8 v31.73,50.8
DIG9  (via drill 0.25)
  Top 0.152: IC2.13 15.39,38.1 14.2,39.29 v14.2,41.15 | v31.75,48.77 29.01,48.77 v28.75,48.51 | U2.29 42.02,48.73 v42.01,48.77
  Bottom 0.152: v14.2,41.15 18.77,45.72 22.43,45.72 23.7,46.99 23.7,47.98 24.49,48.77 26.09,48.77 26.34,48.51 v28.75,48.51 | v42.01,48.77 v31.75,48.77
DIG10
  Top 0.152: U2.30 41.86,47.93 41.27,48.51 41.27,64.29 43.64,66.65 43.64,69.19 44.22,69.77 53.26,69.77 SJ5.1 53.34,68.43 54.84,66.83 63.75,66.83 64.34,67.51 73.91,67.51 74.8,66.62 82.7,66.62 U$1.SEL
DIG11  (via drill 0.25)
  Top 0.152: U2.12 56.07,55.38 v57.51,56.82
  Top 0.229: 3.89,65.99 R9.2
  Top 0.305: R9.2 R27.P$1 | JP5.2 10.16,69.67 7.32,66.83 5.56,66.83 4.72,65.99 3.89,65.99
  Bottom 0.152: v57.51,56.82 57.51,67.77 56.84,68.25 51.54,68.25 50.22,69.75 38.51,69.75 37.95,70.31 37.95,73.38 36.55,74.78 18.26,74.78 17.86,75.18 | 17.86,77.37 JP4.5 | JP5.5 | 10.08,77.52 JP4.2 | JP5.2
  Bottom 0.229: 3.97,62.07 R27.P$1
  Bottom 0.305: 17.86,75.18 17.86,77.37 | JP5.5 JP4.5 17.78,79.3 17.04,79.76 11.28,79.76 10.08,78.38 10.08,77.52 | JP4.2 JP5.2 | Q2.2 3.97,62.07
DIG12  (via drill 0.25)
  Top 0.152: U2.26 44.93,51.13 v43.08,52.98 | v36.8,54.53 33.63,54.53 IC1.12
  Bottom 0.152: v43.08,52.98 38.35,52.98 v36.8,54.53
DIG13  (via drill 0.25)
  Top 0.152: U2.32 40.23,46.33 39.67,46.89 39.17,46.89 39.12,46.94 20.75,46.94 v20.34,46.53 | v13.34,34.34 10.95,34.34 IC2.5
  Bottom 0.152: v20.34,46.53 17.45,46.53 13.34,42.42 v13.34,34.34
GND  (via drill 0.25)  (7 unrouted)
  Top 0.152: U2.35 48.87,43.16 | U2.15 53.67,54.18 53.34,53.85 52.09,53.85 v52.05,53.8 | v51.66,50.72 51.66,49.94 U2.P$1 51.84,49.76 51,49.76 47.23,53.53 U2.23 45.73,53.53 v45.01,54.25 | 90.98,66.34 U$1.GND | 86,70.34 C14.2 | 42.22,38.33 42.29,38.25 | C26.2 48.68,61.89 v48.51,61.72 | v36.96,69.37 36.96,69.56 R8.1 | v39.55,60.76 39.55,60.81 v38.1,62.26 | C21.2 66.89,49.04 | 74.17,78.74 74.88,79.45 76.34,79.45 LED1.C | 77.9,78.74 78.56,79.45 80.37,79.45 80.49,79.27 | 80.49,79.01 LED3.C | JP5.7 JP4.7 | JP4.6 JP5.6 | v70.38,52.35 69.95,52.78 68.1,52.78 67.67,52.45 65.15,52.45 65.02,52.58 65.02,53.17 C23.1 | LED.C 73.14,79.41 73,79.43 70.76,79.43 66.67,75.26 | 72.49,27.94 arc45 72.71,28.03
  Top 0.229: v66.8,49.2 66.8,50.71 C21.2 | C25.1 63.08,64.27 v63.68,64.87 | v63.75,70.64 63.75,71.37 JP3.1 | 7.96,60.5 Q2.1 | 10.11,54.66 JP6.3
  Top 0.254: JP1.2 45.7,71.09
  Top 0.305: 48.87,43.16 48.28,42.57 46.71,42.57 45.47,41.33 44.96,41.33 44.68,41.05 44.68,40.02 C24.1 42.91,38.25 42.29,38.25 | U2.35 48.87,44.48 v50.29,45.95 | v48.9,47.7 49.02,47.7 50.24,48.92 51.46,48.92 U2.P$1 52.87,48.73 55.07,48.73 | U2.5 55.07,48.73 | v55.52,47.7 55.52,48.27 55.07,48.73 | C17.1 56.82,37.58 v56.82,36.7 56.82,34.47 57.89,33.4 C22.2 58.42,30.71 59.69,29.44 65.73,29.44 v65.76,29.46 | J1.6 87.35,57.15 v90.88,60.68 | v90.98,63.58 90.98,66.34 | U$1.GND 90.9,67.98 90.19,68.68 86.74,68.68 86,69.42 86,70.34 | C14.2 86.14,71.2 | 86.14,71.2 86.14,71.54 X10.2 X10.3 | X10.3 X10.4 X10.5 | R43.1 41.06,41.77 42.22,40.62 42.22,38.33 | 89.69,27.08 87.35,29.41 U$6.10 74.02,29.34 72.85,29.34 71.78,30.4 71.78,36.52 70.89,37.41 v70.51,37.41 | R8.1 R28.P$1 38.35,79.76 23.95,79.76 22.86,78.66 JP4.7 | LED.C 74.17,78.74 | LED1.C 77.9,78.74 | 80.49,79.27 80.49,79.01 | X10.3 85.19,78.11 LED2.C | LED3.C 80.76,72.96 80.8,72.92 80.8,72.21 81.48,71.53 84.15,71.53 84.51,71.88 85.46,71.88 86.14,71.2 | 7.96,60.5 6.68,60.5 6.33,60.86 6.33,62.38 7.86,63.92 C12.2 12.76,63.92 12.32,64.36 12.32,72.01 JP5.3 JP4.3 12.9,77.66 12.9,79.05 13.59,79.73 19.48,79.73 20.32,78.9 JP4.6 | Q2.1 8.3,57.72 10.11,55.91 10.11,54.66 | JP4.7 JP4.6 | v70.38,52.35 69.93,51.89 69.93,49.86 68.17,48.11 67.67,48.11 66.89,48.88 66.89,49.04 | 66.67,75.26 66.67,74.3 JP3.1
  Top 0.406: 45.7,71.09 45.7,73.64 JP1.1 41.06,73.66 R8.1 | v58.93,44.7 59.44,44.77 59.66,44.99 3XAAA.- | L3.1 72.49,27.94 | 72.71,28.03 U$6.10
  Bottom 0.152: v52.05,53.8 51.66,53.8 51.16,54.43 49.45,54.43 49.02,53.42 49.02,53.37 v51.66,50.72 | 90.88,63.48 v90.98,63.58 | v48.51,61.72 48.51,61.16 46.13,58.78 45.85,58.78 43.51,61.11 43.51,62.38 42.77,63.12 42.77,63.2 41.71,64.26 41.33,64.57 40.72,64.57 38.61,66.67 | v45.01,54.25 45.01,55.3 v39.55,60.76 | v38.1,62.26 38.1,65.94 38.61,66.67 | 38.61,66.67 38.61,67.72 v36.96,69.37 | 74.95,57.12 J1.6
  Bottom 0.229: 3XAAA.- 60.87,44.99 | 66.73,49.12 v66.8,49.2 | v63.68,64.87 63.68,70.56 v63.75,70.64
  Bottom 0.305: v50.29,45.95 50.29,46.3 v48.9,47.7 | v58.93,44.7 57.96,45.26 | 57.96,45.26 v55.52,47.7 | 57.96,45.26 57.96,37.85 v56.82,36.7 | 60.87,44.99 65,49.12 66.73,49.12 | 90.88,63.48 v90.88,60.68 91.01,60.55 91.01,60.07 87.88,56.95 87.88,48.46 87.05,47.62 81.94,47.62 80.16,45.85 U$9.GND | 74.04,29.46 U$6.10 | v70.38,52.35 73.23,52.35 74.95,54.08 74.95,57.12 | v65.76,29.46 65.76,32.66 v70.51,37.41
  pour Top (isolate 0.305): -2.54,81.28 -2.54,53.34 39.37,53.34 39.37,33.02 70.37,33.02 70.37,-2.54 101.6,-2.54 101.6,81.28
  pour Bottom (isolate 0.305): -1.27,81.28 -1.27,53.34 39.37,53.34 39.37,33.02 70.36,33.02 70.36,-2.54 101.6,-2.54 101.6,81.28
HWB
  Top 0.152: R43.2 43.92,43.18 U2.33
MISO  (via drill 0.25)
  Top 0.152: J1.1 68.81,62.23 67.56,60.98 66.06,60.98 JP3.6 65.94,60.86 65.94,58.62 63.73,56.41 v63.22,55.88 | U2.11 62.7,53.53 v62.71,53.54 | U$1.SDO 81.1,50.42 v77.42,54.1
  Bottom 0.152: v62.71,53.54 62.71,54.86 v63.22,55.88 | v77.42,54.1 77.42,58.95 75.59,60.78 74.73,60.78 74.12,61.39 74.12,61.44 73.41,62.15 72.47,62.15 J1.1
MOSI  (via drill 0.25)
  Top 0.152: JP1.3 50.83,68.58 52.25,66.47 64.01,66.47 64.54,67.18 70.21,67.18 73.79,63.6 | 73.79,63.6 73.79,60.83 J1.4 | 73.79,63.6 86.59,63.6 87.05,64.06 87.05,66.27 U$1.SDI | U2.10 63.6,52.73 v63.68,52.81
  Bottom 0.152: v63.68,52.81 63.68,54.25 64.41,54.99 65.23,54.99 68.1,57.86 68.1,58.47 69.7,60.07 69.7,60.1 70.41,60.81 73.81,60.81 J1.4
N$1  (1 unrouted)
N$2
  Top 0.152: R10.1 71.12,78.22 LED.A
N$3  (2 unrouted)
N$4  (1 unrouted)
N$5  (2 unrouted)
  Top 1.016: 53.75,19.05 53.72,19.02 53.23,19.02 C1.-
N$6  (1 unrouted)
N$7  (via drill 0.25)
  Top 0.152: R29.2 20.32,53.34 21.06,52.6 24.23,52.6 25.17,51.66 25.2,48.39 v25.25,48.21 | v37.29,24.49 37.29,20 C20.+
  Bottom 0.152: v25.25,48.21 25.25,47.04 25.96,46.33 28.4,46.33 29.01,45.72 29.01,36.42 29.69,35.51 29.69,30.81 35.51,25.22 36.55,25.22 v37.29,24.49
N$8
  Top 0.152: R1.1 74.93,78.22 LED1.A
N$9  (via drill 0.25)
  Top 0.152: 52.45,34.33 R11.1 52.16,33.96
  Top 0.305: C1.+ 48.4,22.58 R12.2 52.49,30.72 v52.02,31.19 | R44.1 53.34,36.68 52.45,35.79 52.45,34.33 | v49.58,33.96 52.16,33.96
  Bottom 0.305: v49.58,33.96 49.58,33.63 v52.02,31.19
N$10  (1 unrouted)
N$11
  Bottom 0.813: 90.04,45.59 U$9.ANT
  Bottom 1.016: 90.04,45.59 ANT1.1
N$12  (via drill 0.25)  (2 unrouted)
  Top 0.152: R42.1 67.23,44.11 67.23,36.55 67.69,36.09 67.69,35.48 68.68,34.49 v69.01,34.49
  Bottom 0.152: 69.88,33.63 v69.01,34.49
N$13
  Top 1.016: X10.1 90.25,75.56 90.25,71.81 91.26,70.94 94.84,69.88 U$1.ANT
N$14
  Top 1.016: R26.P$2 16.54,13.95 16.54,12.17 15.18,10.81 X3.1 12.83,13.1 R16.2 12.56,14.24 C15.-
N$15  (2 unrouted)
  Top 0.152: R45.1 67.69,46.99 68.48,46.2 68.48,41.55 68,41.07 68,37.01 70.23,34.77 70.23,29.23 69.9,28.91
N$16  (via drill 0.25)
  Top 0.152: R31.2 37.5,40.22 36.12,41.6 36.12,42.01 35.59,42.55 30.58,42.55 30.33,42.8 30.33,43.94 30.56,44.17 30.73,44.17 v30.94,44.27 | v30.89,53.37 27.43,53.37 IC1.4
  Top 0.229: R30.1 24.52,55.03 26.21,53.34 IC1.4
  Bottom 0.152: v30.94,44.27 30.94,53.31 v30.89,53.37
N$17
  Top 0.229: IC1.1 27.36,57.1 25.78,57.1 25.41,56.73 R30.2 R29.1
N$18
  Top 0.152: 20.46,38.32 20.32,38.41
  Top 0.178: 20.32,38.41 20.32,40.54
  Top 0.203: 20.32,40.54 19.07,41.76 19.07,46.59 R2.2
  Top 0.305: C13.+ 20.46,38.32
N$19
  Top 0.152: R35.1 82.55,78.22 LED2.A
N$20
  Top 1.016: R25.P$1 29.16,13.92 29.16,12.8 27.88,11.52 X2.1 25.53,13.1 R3.1 25.26,14.24 C13.-
N$21  (2 unrouted)
  Top 1.016: R6.2 39.5,11.83 | 43.18,13.35 R24.P$2 43.18,18.91 C20.-
N$22  (via drill 0.25)
  Top 0.152: R5.1 27.47,25.64 26.16,26.49 26.16,28.22 27.25,28.91 | 27.25,28.91 28.27,28.91 28.78,29.41 | 28.78,29.41 28.78,30.47 R7.1 28.79,29.43 28.78,29.41 | 27.25,28.91 26.11,28.91 24.74,30.28 24.74,37.39 25.45,38.1 IC3.12 28.07,38.1 28.47,38.51 28.47,40.34 | 28.47,40.34 28.25,40.56 26.69,40.56 IC3.10 | 28.47,40.34 28.78,40.64 IC3.5 31.86,40.69 32.92,40.69 33.4,41.17 v33.68,41.17 | IC3.3 33.55,38.1 v34.06,38.61
  Top 0.305: C11.+ 30.15,24.25 R5.1
  Bottom 0.152: v34.06,38.61 34.06,40.79 v33.68,41.17
N$23
  Top 0.305: C15.+ 7.76,30.76 R15.1
N$24
  Top 0.152: R2.1 23.5,48.26 24.46,47.24 32.87,47.24 33.63,48.11 33.63,49.45 IC1.8 37.68,49.53 R4.2
N$25
  Top 0.152: IC1.11 33.81,53.09 35.43,53.09 36.87,51.65 R4.1 38.57,51.65 39.93,50.29 39.93,49.78 39.45,49.3 39.24,49.3 38.61,48.67 38.61,48.35 R21.2
N$26  (via drill 0.25)
  Top 0.152: R18.2 50.8,38.02 v49.17,36.4 | v39.83,45.09 39.54,45.09 R22.1 37.4,44.35 v36.37,44.35 | IC3.7 34.59,43.18 v34.65,43.13
  Bottom 0.152: v49.17,36.4 42.47,36.4 40.21,38.66 40.21,44.7 v39.83,45.09 | v34.65,43.13 35.15,43.13 v36.37,44.35
N$27  (via drill 0.25)
  Top 0.152: IC3.6 34.44,41.91 v34.54,42.01 | v36.7,41.99 38.06,41.99 R22.2 | R21.1 34,46.14 v33.73,45.87 | IC1.10 IC1.9 32.79,50.8 31.95,49.96 31.95,49.33 32.16,49.12 32.16,49.1 32.49,48.77 32.49,48.16 v32.56,48.08
  Bottom 0.152: v36.7,41.99 36.68,42.01 v34.54,42.01 33.73,42.82 v33.73,45.87 32.56,47.04 v32.56,48.08
N$28  (via drill 0.25)
  Top 0.152: R31.1 R32.2 33.39,36.41 33.07,36.73 31.91,36.73 IC3.2 30.2,36.83 v29.82,37.21 | v29.67,54.51 27.51,54.51 IC1.3 IC1.2
  Bottom 0.152: v29.82,37.21 29.82,54.36 v29.67,54.51
N$29
  Top 0.152: R19.2 45.72,37.82 43.79,35.89 41.2,35.89 40.18,34.87 38.26,34.87 R32.1 32.66,34.71 IC3.1
N$30
  Top 0.152: R36.1 78.74,78.22 LED3.A
N$31  (via drill 0.25)
  Top 0.152: IC3.9 26.56,41.86 25.53,41.86 24.93,42.46 R34.1 23.69,42.52 v21.92,42.52 | IC2.2 12.5,38.1 12.9,38.51 12.9,42.11 v12.14,42.88 | v13.74,45.03 16.38,45.03 v17.88,43.54
  Top 0.305: R33.2 10.48,37.25 IC2.3 IC2.2
  Bottom 0.152: v12.14,42.88 12.14,43.43 v13.74,45.03 | v17.88,43.54 20.9,43.54 v21.92,42.52
N$32
  Top 0.152: IC3.14 IC3.13
N$33
  Top 0.152: R20.1 48.25,38.53 47.65,38.53 46.84,39.34 44.78,39.34 44.48,39.04 44.48,37.64 44.12,37.29 42.32,37.29 41.68,37.92 41.68,39.95 38.84,42.8 37.26,42.8 37.16,42.9 35.84,42.9 35.43,43.31 35.43,43.92 34.47,44.88 27.18,44.88 26.61,44.31 IC3.8 25.63,44.16 R34.2
N$34
  Top 0.229: IC2.1 9.75,40.51 5.71,40.51 5.08,39.88 R17.1 4.18,38.95 3.53,38.3 3.53,35.41 3.73,35.2 5.02,35.2 R15.2
N$35
  Top 0.152: 6.6,38.05 6.6,37.87 6.45,37.72 | 5.24,37.41 5.69,37.41
  Top 0.229: 5.24,37.41 R17.2
  Top 0.305: 6.6,37.87 6.6,36.35 6.88,36.07 10.39,36.07 IC2.4 | 5.69,37.41 5.99,37.72 6.45,37.72 | R33.1 7.5,38.95 6.6,38.05
N$36  (1 unrouted)
RD+
  Top 0.229: U2.4 61.87,47.93 62.84,46.97 65.17,46.97 R45.2
RD-
  Top 0.229: U2.3 61.56,47.13 62.2,46.48 62.23,46.48 62.53,46.18 63.46,46.18 R42.2
RST  (1 unrouted)
  Top 0.152: U2.13 55.27,56.46 56.49,57.68 57.89,57.68 60.45,55.24 70.36,55.24 J1.5 72.39,56.84 73.94,55.3 95.02,55.3 99.29,51.03 99.29,28.73 97.48,26.92 R37.1
RX  (via drill 0.25)
  Top 0.152: v50.55,53.65 49.67,54.52 U2.20 49.67,56.43 v48.64,57.45 | v52.88,51.84 52.88,53.11 53.21,53.44 54.23,53.44 v55.85,51.82 | v77.06,51.64 77.06,51.54 78.59,50.01 78.59,43.89 v78.16,43.46 | v75.89,43.87 75.63,43.87 U$6.2 | JP5.11 32.97,72.34 32.97,68.48 34.8,66.65 37.08,66.65 40.01,63.73 v40.03,63.73
  Top 0.305: JP4.11 JP5.11
  Bottom 0.152: v50.55,53.65 51.08,53.65 v52.88,51.84 | v55.85,51.82 67.69,51.82 68.1,51.41 73.58,51.41 75.21,53.03 76.48,53.03 77.17,52.35 77.17,51.74 v77.06,51.64 | v78.16,43.46 76.3,43.46 v75.89,43.87 | v48.64,57.45 46.2,57.45 42.11,61.54 42.11,61.65 v40.03,63.73
SCK  (via drill 0.25)
  Top 0.152: 68.44,51.93 v68.58,52.07 | JP1.4 63.88,66.04 65,64.92 69.47,64.92 v70.64,63.75 | v70.66,61.57 70.66,61.42 J1.3 73.66,58.42 v81.13,58.42 | U2.9 63.03,51.93 63.75,52.05 68.56,52.05 v68.58,52.07 | 68.53,52.02 v68.58,52.07 | U$1.SCK 84.9,64.28 v84.89,64.26
  Bottom 0.152: v68.58,52.07 68.58,57.28 70.81,59.51 72.21,59.51 J1.3 | v70.64,63.75 70.64,61.59 v70.66,61.57 | v84.89,64.26 84.89,62.18 v81.13,58.42
SS  (via drill 0.25)
  Top 0.152: U2.8 55.37,51.13 v53.87,52.63 | v55.88,67.54 55.88,69.14 56.01,69.27 56.01,69.72 SJ5.2 | R35.2 82.55,72.77 82.6,72.72 82.35,72.72 81.41,73.66 81.41,75.41 81.92,75.92 81.92,79.53 81.81,79.83 60.33,79.83 58.47,77.93 58.47,69.9 SJ5.3
  Top 0.305: SJ5.3 SJ5.2
  Bottom 0.152: v53.87,52.63 53.87,56.46 55.91,58.5 55.91,63.68 | 55.91,63.68 55.91,67.41 v55.88,67.54 | JP1.5 46.63,63.5 47.65,64.52 55.07,64.52 55.91,63.68
TX  (via drill 0.25)
  Top 0.152: v55.52,50.22 54.33,50.22 54.13,50.42 52.98,50.42 48.87,54.53 U2.21 48.87,54.18 48.41,53.72 48.26,53.72 46.43,55.55 46.41,55.52 v42.85,55.52 | v70.08,43.38 74.06,43.38 U$6.3 | v39.19,55.55 36.27,58.47 36.27,60.73 32.87,64.14 31.9,64.14 v30.48,65.56
  Top 0.305: JP4.10 JP5.10
  Bottom 0.152: v55.52,50.22 68.58,50.22 70,48.79 70,43.46 v70.08,43.38 | U$6.3 75.03,43.41 76.5,41.94 78.89,41.94 U$9.DATA | v30.48,65.56 JP5.10 | v39.19,55.55 42.82,55.55 v42.85,55.52
TXLED  (via drill 0.25)
  Top 0.152: U2.22 48.07,56.55 46.23,58.4 46.23,58.57 44.42,60.38 44.42,64.16 45.16,64.9 61.82,64.9 v62.61,65.43 | v78.72,71.45 78.72,72.78 R36.2
  Bottom 0.152: v62.61,65.43 62.61,70.84 64.08,72.31 68.02,72.31 69.04,71.3 78.56,71.3 v78.72,71.45
UCAP
  Top 0.152: U2.6 63.14,49.53 64.26,50.65 65.04,50.65 C21.1
VUSB  (via drill 0.25)  (3 unrouted)
  Top 0.152: U2.7 62.88,50.33 64.24,51.69 65.81,51.69 65.99,51.51 65.99,51.44 66.04,51.38 66.04,41.15 | 66.04,41.15 66.04,36.5 68.81,33.73 68.81,29.59 v69.29,29.11 | U2.2 60.05,46.33 60.2,46.48 61.21,46.48 62.23,45.47 62.23,44.96 66.04,41.15
XTAL1
  Top 0.305: U2.17 52.12,55.38 52.12,57.35 51.05,58.42 XTAL1.1 50.38,60.36 C26.1
XTAL2
  Top 0.305: U2.16 52.86,55.34 52.86,57.51 53.19,57.84 54.59,57.84 56.44,59.69 XTAL1.2 60.35,59.33 60.35,59.23 61.38,60.26 C25.2

### Text on the board
bPlace: ROHS
_tsilk: Ethernet | DIG7 | DIG23 | Dig17 | Wiznet 820io W5200 | Wiznet SPI SS | Minimum size for silkscreen text is 30 mills | 5V | 5V | TX | RX | Optional Pull-down | GND | GND | GND | DIG10 | DIG17 | ADC4 | DS18B20 Temp | 1wire DIG11 | DS18B20 Temp | 1wire DIG11 | DIG 5 PWM | INT1 DIG2 | Pulse Counting IRQ | JeePort | 5V | DIG5 | GND | 3.3V | ADC4 | INT1 DIG 2 | - | GND Tx 5V | wireless energy | + | Designed in | monitoring node | XBEE | North Wales | 3 x AA Battery holder | Made in UK | OpenEnergyMonitor.org | emonTx | SMT V0.6 rev3 | AC Power Supply | Solder to enable | + | Push button | - | function selection | DIG22 | RST | 3V - 13V | Aux Power | 3-5.5V MAX if | using DS18B20 | RST
_bsilk: Aug 2012 | RFM12B Frequency | 433Mhz | 868Mhz | 915Mhz | Lead free PCB | SMT V0.6 rev3 | emonTx | Made in UK | wireless energy monitoring node | Technology that helps us live within ecological limits | Designed in North Wales UK by Glyn Hudson & Trystan Lea | OpenEnergyMonitor.org | Open-Hardware